# Altium schematic sheet Aux_Lights_Daughter_REV2_1.SchDoc
size Letter
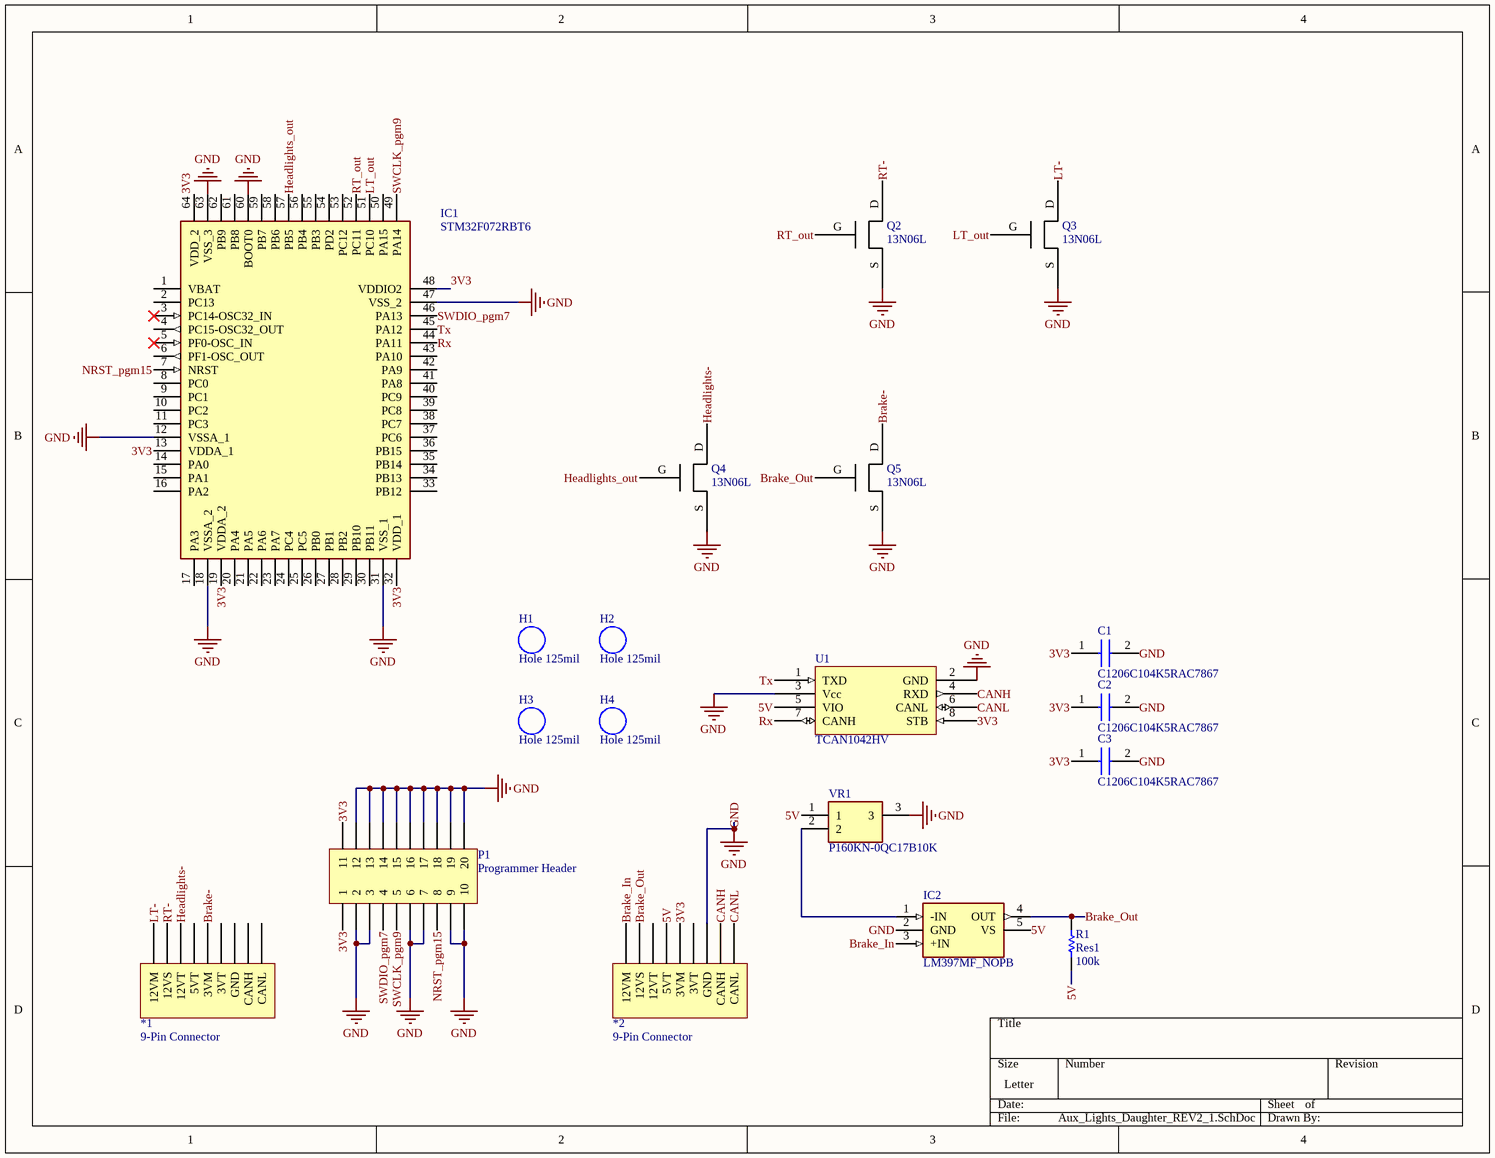
[diagram p0: Aux_Lights_Daughter_REV2_1.SchDoc]

## Parts
*1  9-Pin Connector  [9-Pin]
*2  9-Pin Connector  [9-Pin]
C1  C1206C104K5RAC7867  [CAPC3216X110N]
C2  C1206C104K5RAC7867  [CAPC3216X110N]
C3  C1206C104K5RAC7867  [CAPC3216X110N]
H1  Hole 125mil  [Hole 125mil]
H2  Hole 125mil  [Hole 125mil]
H3  Hole 125mil  [Hole 125mil]
H4  Hole 125mil  [Hole 125mil]
IC1  STM32F072RBT6  [QFP50P1200X1200X160-64N]
IC2  LM397MF_NOPB  [SOT95P280X145-5N]
P1  Programmer Header  [HDR2X10_CEN]
Q2  13N06L  [13N06L]
Q3  13N06L  [13N06L]
Q4  13N06L  [13N06L]
Q5  13N06L  [13N06L]
R1  Res1  value 100k  [AXIAL-0.3]
U1  TCAN1042HV  [CANIC]
VR1  P160KN-0QC17B10K  [POT inline wide]

## Nets
GND: *2.7(GND) C1.2 C2.2 C3.2 IC1.12(VSSA_1) IC1.18(VSSA_2) IC1.31(VSS_1) IC1.47(VSS_2) IC1.60(BOOT0) IC1.63(VSS_3) IC2.2(GND) P1.2 P1.3 P1.6 P1.7 P1.9 P1.10 P1.12 P1.13 P1.14 P1.15 P1.16 P1.17 P1.18 P1.19 P1.20 Q2.S Q3.S Q4.S Q5.S U1.2(GND) U1.3(Vcc) VR1.3
3V3: *2.5(3VM) C1.1 C2.1 C3.1 IC1.13(VDDA_1) IC1.19(VDDA_2) IC1.32(VDD_1) IC1.48(VDDIO2) IC1.64(VDD_2) P1.1 P1.11 U1.8(STB)
5V: *2.4(5VT) IC2.5(VS) R1.1 U1.5(VIO) VR1.1
Brake-: *1.5(3VM) Q5.D
Brake_In: *2.1(12VM) IC2.3(+IN)
Brake_Out: *2.2(12VS) IC2.4(OUT) Q5.G R1.2
CANH: *2.8(CANH) U1.4(RXD)
CANL: *2.9(CANL) U1.6(CANL)
Headlights-: *1.3(12VT) Q4.D
Headlights_out: IC1.57(PB5) Q4.G
LT-: *1.1(12VM) Q3.D
LT_out: IC1.51(PC10) Q3.G
NRST_pgm15: IC1.7(NRST) P1.8
RT-: *1.2(12VS) Q2.D
RT_out: IC1.52(PC11) Q2.G
Rx: IC1.44(PA11) U1.7(CANH)
SWCLK_pgm9: IC1.49(PA14) P1.5
SWDIO_pgm7: IC1.46(PA13) P1.4
Tx: IC1.45(PA12) U1.1(TXD)
NetIC2_1: IC2.1(-IN) VR1.2

Not connected (* = marked no-connect by the designer): *1 4(5VT) 6(3VT) 7(GND) 8(CANH) 9(CANL); *2 3(12VT) 6(3VT); IC1 1(VBAT) 2(PC13) 3(PC14-OSC32_IN)* 4(PC15-OSC32_OUT) 5(PF0-OSC_IN)* 6(PF1-OSC_OUT) 8(PC0) 9(PC1) 10(PC2) 11(PC3) 14(PA0) 15(PA1) 16(PA2) 17(PA3) 20(PA4) 21(PA5) 22(PA6) 23(PA7) 24(PC4) 25(PC5) 26(PB0) 27(PB1) 28(PB2) 29(PB10) 30(PB11) 33(PB12) 34(PB13) 35(PB14) 36(PB15) 37(PC6) 38(PC7) 39(PC8) 40(PC9) 41(PA8) 42(PA9) 43(PA10) 50(PA15) 53(PC12) 54(PD2) 55(PB3) 56(PB4) 58(PB6) 59(PB7) 61(PB8) 62(PB9)

## Library data of the parts
C1-C3 = C1206C104K5RAC7867: Capacitor; Manufacturer_Name: Kemet; Datasheet Link: https://componentsearchengine.com/Datasheets/1/C1206C104K5RAC7867.pdf; Height: 1.1mm; Mouser2 Part Number: 80-C1206104K5RAC7867; Mouser2 Price/Stock: https://www.mouser.com/Search/Refine.aspx?Keyword=80-C1206104K5RAC7867; Manufacturer_Part_Number: C1206C104K5RAC7867
IC1 = STM32F072RBT6: Integrated Circuit; Manufacturer_Name: STMicroelectronics; Datasheet Link: https://componentsearchengine.com/Datasheets/1/STM32F072RBT6.pdf; Height: 1.6mm; Mouser Part Number: 511-STM32F072RBT6; Mouser Price/Stock: https://www.mouser.com/Search/Refine.aspx?Keyword=511-STM32F072RBT6; Manufacturer_Part_Number: STM32F072RBT6
IC2 = LM397MF_NOPB: Integrated Circuit; Manufacturer_Name: Texas Instruments; Manufacturer_Part_Number: LM397MF/NOPB; Datasheet Link: http://www.ti.com/lit/ds/symlink/lm397.pdf; Height: 1.45mm; Mouser Part Number: 926-LM397MF/NOPB; Mouser Price/Stock: https://www.mouser.com/Search/Refine.aspx?Keyword=926-LM397MF%2FNOPB
P1 = Header 10X2A: Header, 10-Pin, Dual row; LatestRevisionDate: 17-Jul-2002; LatestRevisionNote: Re-released for DXP Platform.; Publisher: Altium Limited
R1 = Res1: Resistor; Published: 8-Jun-2000; LatestRevisionDate: 17-Jul-2002; LatestRevisionNote: Re-released for DXP Platform.; PackageReference: AXIAL-0.3; Publisher: Altium Limited; PackageDescription: Axial Device, Thru-Hole; 2 Leads; 0.3 in Pin Spacing
U1 = TCAN1042HV: TCAN1042Fault ProtectedCAN Transceiverwith CAN FD; ComponentLink1Description: Datasheet; ComponentLink1URL: http://www.ti.com/lit/ds/symlink/tcan1042hgv.pdf
VR1 = P160KN-0QC17B10K: Variable Resistor; Manufacturer_Name: BI Technologies; Datasheet Link: https://componentsearchengine.com/Datasheets/1/P160KN-0QC17B10K.pdf; Height: 16.5mm; Mouser Part Number: 858-P160KN-OQC17B10K; Mouser Price/Stock: https://www.mouser.com/Search/Refine.aspx?Keyword=858-P160KN-OQC17B10K; Manufacturer_Part_Number: P160KN-0QC17B10K